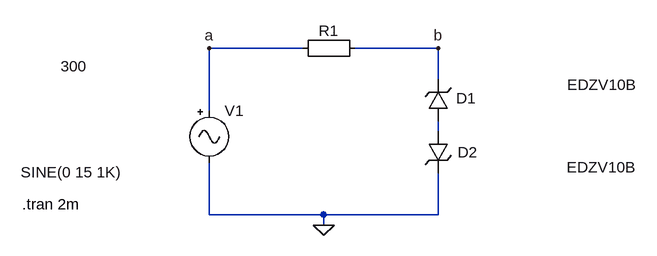
[diagram p0: schematic Z-CL-B-SIN.asc]
Z-CL-B-SIN.asc, the LTspice schematic file:
Version 4
SHEET 1 880 680
WIRE 16 48 -128 48
WIRE 224 48 96 48
WIRE 224 96 224 48
WIRE -128 144 -128 48
WIRE 224 176 224 160
WIRE -128 304 -128 224
WIRE 48 304 -128 304
WIRE 224 304 224 240
WIRE 224 304 48 304
WIRE 48 320 48 304
FLAG -128 48 a
FLAG 224 48 b
FLAG 48 320 0
SYMBOL Misc\\EuropeanResistor 0 64 R270
WINDOW 0 27 56 VTop 2
WINDOW 3 4 -336 VBottom 2
SYMATTR InstName R1
SYMATTR Value 300
SYMBOL zener 240 160 R180
WINDOW 0 -43 35 Left 2
WINDOW 3 -289 56 Left 2
SYMATTR InstName D1
SYMATTR Value EDZV10B
SYMATTR Description Diode
SYMATTR Type diode
SYMBOL zener 208 176 R0
WINDOW 0 46 32 Left 2
WINDOW 3 214 55 Left 2
SYMATTR InstName D2
SYMATTR Value EDZV10B
SYMATTR Description Diode
SYMATTR Type diode
SYMBOL Misc\\signal -128 128 R0
WINDOW 123 0 0 Left 2
WINDOW 39 0 0 Left 2
WINDOW 3 -290 111 Left 2
SYMATTR InstName V1
SYMATTR Value SINE(0 15 1K)
TEXT -416 288 Left 2 !.tran 2m

The netlist it stands for:
* Z-CL-B-SIN.asc
R1 a b 300
D1 N001 b EDZV10B
D2 N001 0 EDZV10B
V1 a 0 SINE(0 15 1K)
.model D D
.lib standard.dio
.tran 2m
.backanno
.end